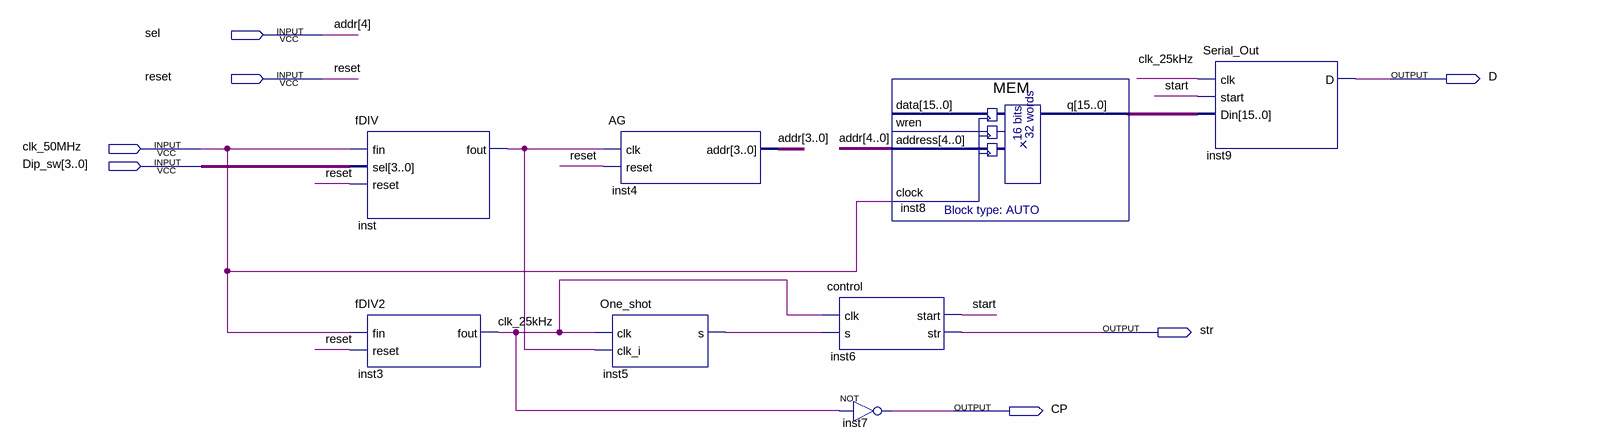
[diagram p0: schematic sheet]
// Quartus schematic LED_v2.bdf as structural Verilog: 8 symbols, 7 pins
module LED_v2 (
  input  sel,
  input  reset,
  input  clk_50MHz,
  input  [3:0] Dip_sw,
  output D,
  output str,
  output CP
);

  wire clk_25kHz, inst5_s, inst_fout, start;
  wire [3:0] addr;
  wire [15:0] inst8_q;

  fDIV inst (.fin(clk_50MHz), .sel(Dip_sw), .reset(reset), .fout(inst_fout));
  fDIV2 inst3 (.fin(clk_50MHz), .reset(reset), .fout(clk_25kHz));
  AG inst4 (.clk(inst_fout), .reset(reset), .addr(addr));
  One_shot inst5 (.clk(clk_25kHz), .clk_i(inst_fout), .s(inst5_s));
  control inst6 (.clk(clk_25kHz), .s(inst5_s), .start(start), .str(str));
  not inst7 (CP, clk_25kHz);
  MEM inst8 (.address({sel, addr}), .clock(clk_50MHz), .q(inst8_q));  // open: data, wren
  Serial_Out inst9 (.clk(clk_25kHz), .start(start), .Din(inst8_q), .D(D));

  // Other names for the same wires on the sheet: addr[4] = sel
endmodule
